# Altium project STM32F407.PrjPcb
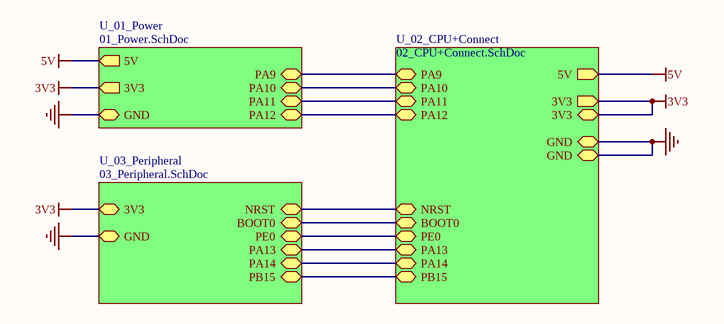
[diagram p0: STM32F407.SchDoc]
4 sheets, 49 parts. Net scope: hierarchical (ports join the sheet entries above them; power ports are global).
Board file: STM32F407.PcbDoc
Sheets:
  STM32F407.SchDoc
    U_01_Power = 01_Power.SchDoc
    U_02_CPU+Connect = 02_CPU+Connect.SchDoc
    U_03_Peripheral = 03_Peripheral.SchDoc

## Sheet STM32F407.SchDoc
size A4; SheetNumber: 1; SheetTotal: 4

### Sub-sheets
U_01_Power = 01_Power.SchDoc: 3V3 (out), GND (bidir), PA9 (bidir), PA10 (bidir), PA11 (bidir), PA12 (bidir), 5V (out)
U_02_CPU+Connect = 02_CPU+Connect.SchDoc: 3V3 (bidir), GND (bidir), NRST (bidir), PB15 (bidir), BOOT0 (bidir), PE0 (bidir), PA13 (bidir), PA14 (bidir), 3V3 (out), GND (bidir), PA9 (bidir), PA10 (bidir), PA11 (bidir), PA12 (bidir), 5V (out)
U_03_Peripheral = 03_Peripheral.SchDoc: 3V3 (bidir), GND (bidir), NRST (bidir), PB15 (bidir), BOOT0 (bidir), PE0 (bidir), PA13 (bidir), PA14 (bidir)

### Nets
3V3: sheet U_01_Power/3V3, sheet U_02_CPU+Connect/3V3, sheet U_02_CPU+Connect/3V3, sheet U_03_Peripheral/3V3
5V: sheet U_01_Power/5V, sheet U_02_CPU+Connect/5V
GND: sheet U_01_Power/GND, sheet U_02_CPU+Connect/GND, sheet U_02_CPU+Connect/GND, sheet U_03_Peripheral/GND
BOOT0: sheet U_02_CPU+Connect/BOOT0, sheet U_03_Peripheral/BOOT0
NRST: sheet U_02_CPU+Connect/NRST, sheet U_03_Peripheral/NRST
PA9: sheet U_01_Power/PA9, sheet U_02_CPU+Connect/PA9
PA10: sheet U_01_Power/PA10, sheet U_02_CPU+Connect/PA10
PA11: sheet U_01_Power/PA11, sheet U_02_CPU+Connect/PA11
PA12: sheet U_01_Power/PA12, sheet U_02_CPU+Connect/PA12
PA13: sheet U_02_CPU+Connect/PA13, sheet U_03_Peripheral/PA13
PA14: sheet U_02_CPU+Connect/PA14, sheet U_03_Peripheral/PA14
PB15: sheet U_02_CPU+Connect/PB15, sheet U_03_Peripheral/PB15
PE0: sheet U_02_CPU+Connect/PE0, sheet U_03_Peripheral/PE0

## Sheet 01_Power.SchDoc
size A4; SheetNumber: 2; SheetTotal: 4
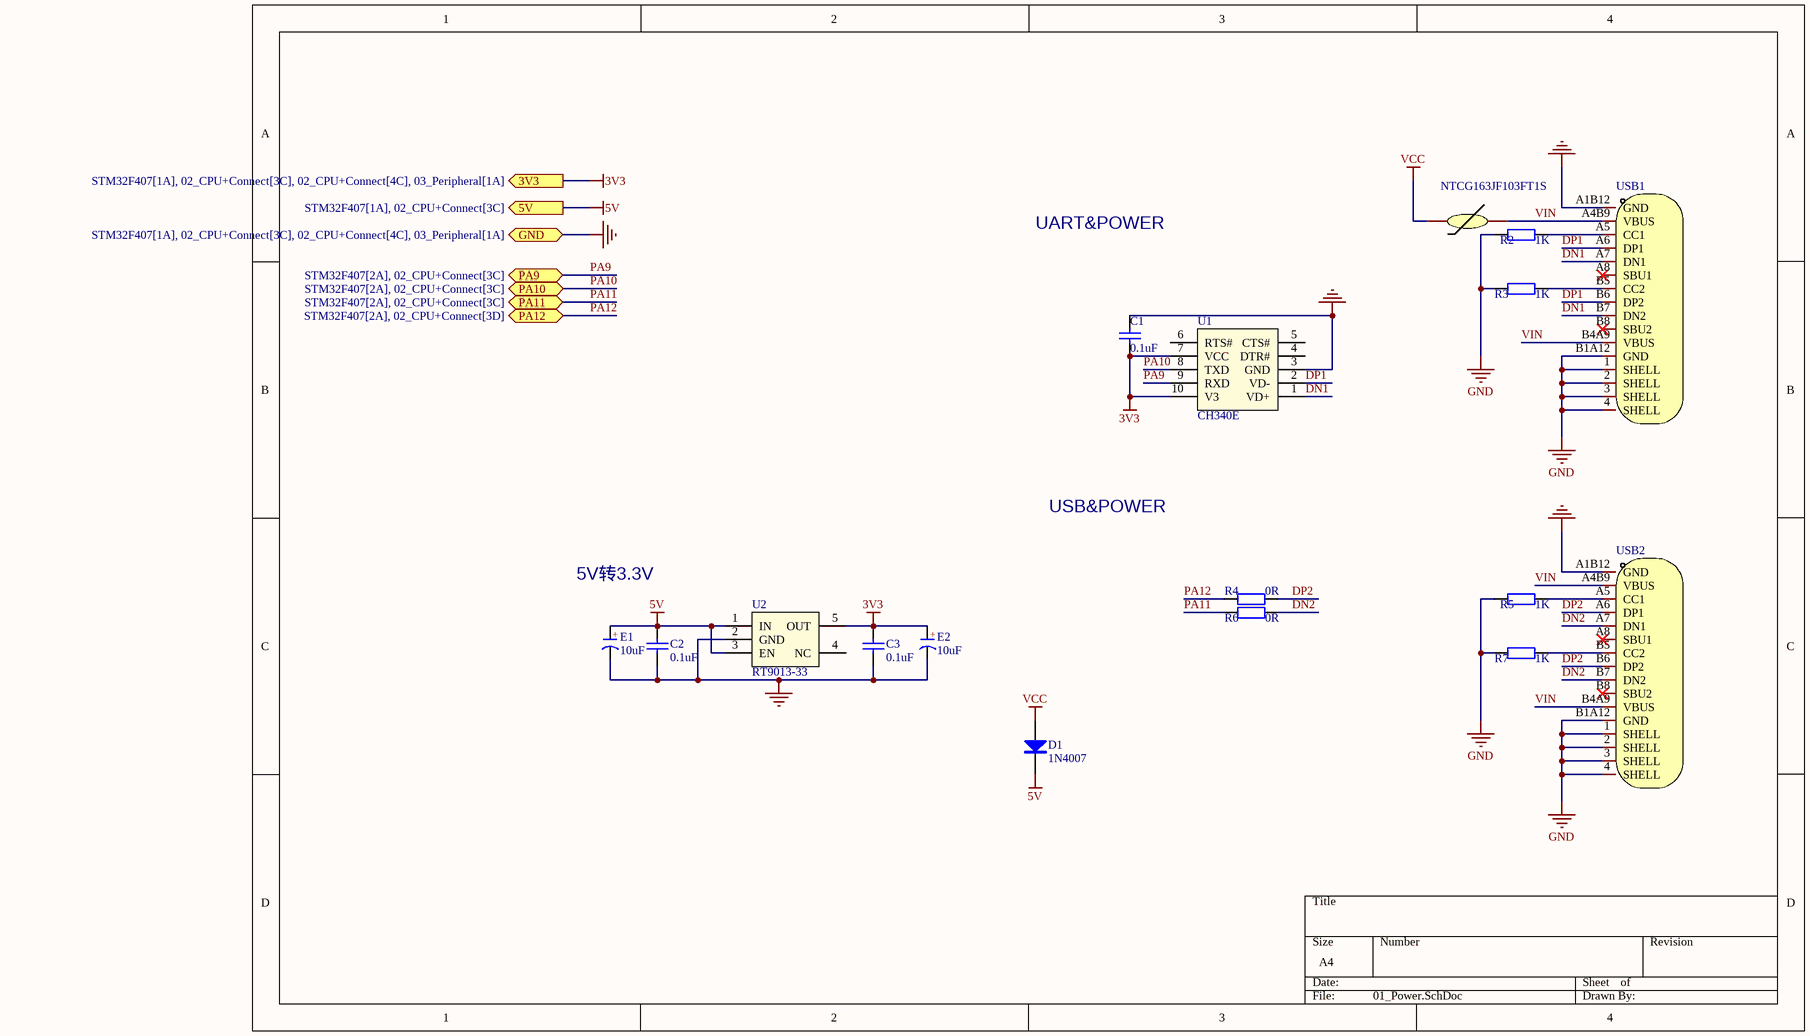
[diagram p1: 01_Power.SchDoc]

### Parts
C1  0.1uF  [C 0402_L]
C2  0.1uF  [C 0402_L]
C3  0.1uF  [C 0402_L]
D1  1N4007  [SOD-123]
E1  10uF  [CD A(3216)]
E2  10uF  [CD A(3216)]
R1  NTCG163JF103FT1S  [R0603]
R2  1K  [R 0402_L]
R3  1K  [R 0402_L]
R4  0R  [R 0402_L]
R5  1K  [R 0402_L]
R6  0R  [R 0402_L]
R7  1K  [R 0402_L]
U1  CH340E  [MSOP10_L]
U2  RT9013-33  [SOT23-5N]
USB1  TYPE-C 16P(073)  [USB-C-SMD_TYPE-C16PIN_C668624]  (value not drawn)
USB2  TYPE-C 16P(073)  [USB-C-SMD_TYPE-C16PIN_C668624]  (value not drawn)

### Ports
3V3 (out, see STM32F407[1A], 02_CPU+Connect[3C], 02_CPU+Connect[4C], 03_Peripheral[1A]), 5V (out, see STM32F407[1A], 02_CPU+Connect[3C]), GND (bidir, see STM32F407[1A], 02_CPU+Connect[3C], 02_CPU+Connect[4C], 03_Peripheral[1A]), PA9 (bidir, see STM32F407[2A], 02_CPU+Connect[3C]), PA10 (bidir, see STM32F407[2A], 02_CPU+Connect[3C]), PA11 (bidir, see STM32F407[2A], 02_CPU+Connect[3C]), PA12 (bidir, see STM32F407[2A], 02_CPU+Connect[3D])

### Nets
3V3: C1.2 C3.2 E2.1(A) U1.7(VCC) U1.10(V3) U2.5(OUT) ; port 3V3
5V: C2.2 D1.2(K) E1.1(A) U2.1(IN) U2.3(EN) ; port 5V
GND: C1.1 C2.1 C3.1 E1.2(K) E2.2(K) R2.1 R3.1 R5.1 R7.1 U1.3(GND) U2.2(GND) USB1.1(SHELL) USB1.2(SHELL) USB1.3(SHELL) USB1.4(SHELL) USB1.A1B12(GND) USB1.B1A12(GND) USB2.1(SHELL) USB2.2(SHELL) USB2.3(SHELL) USB2.4(SHELL) USB2.A1B12(GND) USB2.B1A12(GND) ; port GND
VCC: D1.1(A) R1.1
DN1: U1.1(VD+) USB1.A7(DN1) USB1.B7(DN2)
DN2: R6.1 USB2.A7(DN1) USB2.B7(DN2)
DP1: U1.2(VD-) USB1.A6(DP1) USB1.B6(DP2)
DP2: R4.1 USB2.A6(DP1) USB2.B6(DP2)
PA9: U1.9(RXD) ; port PA9
PA10: U1.8(TXD) ; port PA10
PA11: R6.2 ; port PA11
PA12: R4.2 ; port PA12
VIN: R1.2 USB1.A4B9(VBUS) USB1.B4A9(VBUS) USB2.A4B9(VBUS) USB2.B4A9(VBUS)
NetR2_2: R2.2 USB1.A5(CC1)
NetR3_2: R3.2 USB1.B5(CC2)
NetR5_2: R5.2 USB2.A5(CC1)
NetR7_2: R7.2 USB2.B5(CC2)

Not connected (* = marked no-connect by the designer): U1 4(DTR#) 5(CTS#) 6(RTS#); U2 4(NC); USB1 A8(SBU1)* B8(SBU2)*; USB2 A8(SBU1)* B8(SBU2)*

### Notes on the sheet
- UART&POWER
- USB&POWER
- 5V转3.3V
- (in symbol C-CD) +

### Library data of the parts
C1-C3 = Cap
D1 = 1N4007: 整流二极管; BOM名称: 整流二极管
E1 E2 = C-CD: 贴片钽电容; BOM名称: 贴片钽电容
R1 = NTCG163JF103FT1S: 阻值(25℃):10kΩ;电阻精度:±1%;B值精度:±1%;B值(25℃/50℃):3380K;功率:100mW;最大稳态电流(25℃):310uA;B值(25℃/75℃):3422K;B值(25℃/85℃):3435K;B值(25℃/100℃):3453K;工作温度:-40℃~+150℃;; Manufacturer: TDK; Add into BOM: yes; Resistance @ 25℃: 10kΩ; Resistance Tolerance: ±1%; B Constant (25℃/50℃): 3380K; Power: 100mW; Steady State Current (Max): 310uA; B Constant (25℃/75℃): 3422K; B Constant (25℃/85℃): 3435K; B Constant (25℃/100℃): 3453K; Symbol: NTCG163JF103FT1S; Device: NTCG163JF103FT1S; LCSC Part Name: 10kΩ 电阻精度:±1% 3380K; Supplier Part: C406719; Manufacturer Part: NTCG163JF103FT1S; Supplier Footprint: 0603; JLCPCB Part Class: 扩展库; Datasheet: https://atta.szlcsc.com/upload/public/pdf/source/20190723/C406719_56E4CA7886271F3E26D47484E1680181.pdf; Supplier: LCSC; Convert to PCB: yes; B Constant Tolerance: ±1%; Operating Temperature: -40℃~+150℃; Name: NTCG163JF103FT1S
R2-R7 = Res
USB1 USB2 = TYPE-C 16P(073): 连接器类型:Type-C;标准:-;公母:母座;触点数量:16;端口数量:1;安装方式:卧贴;额定电流 - 电源:5A;工作温度范围:-25℃~+85℃;; Manufacturer: SHOU HAN(首韩); Add into BOM: yes; Gender: 母座; Number of Contacts: 16; Number of Ports: 1; Mounting Sytle: 卧贴; Current Rating - Power (Max): 5A; Symbol: TYPE-C 16P(073); Device: TYPE-C 16P(073); LCSC Part Name: TYPE-C母座 16P 4脚插件带定位柱 不锈钢外壳 3次模顶; Supplier Part: C668624; Manufacturer Part: TYPE-C 16P(073); Supplier Footprint: SMD; JLCPCB Part Class: 扩展库; Datasheet: https://atta.szlcsc.com/upload/public/pdf/source/20200618/C668624_CC51EC37614090AAD56C1421DE954C80.pdf; Supplier: LCSC; Convert to PCB: yes; Connector Type: Type-C; Standard: -; Operating Temperature Range: -25℃~+85℃; NO_CONNECT: yes; Name: TYPE-C 16P(073)

## Sheet 02_CPU+Connect.SchDoc
size A4; SheetNumber: 3; SheetTotal: 4
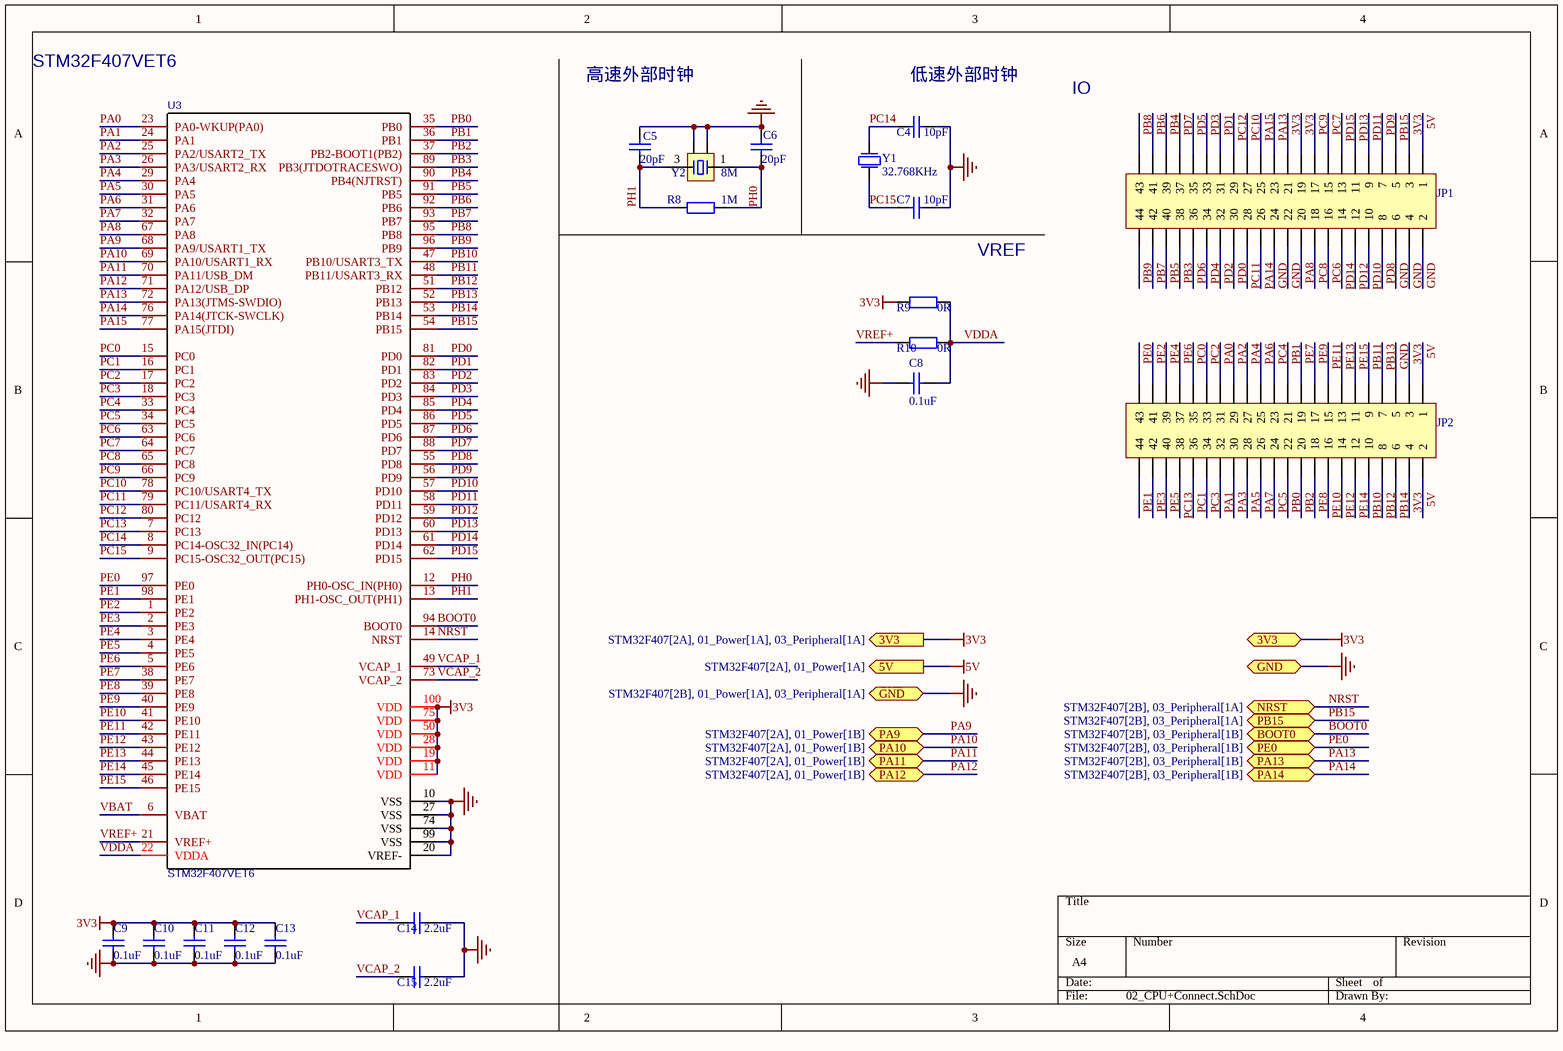
[diagram p2: 02_CPU+Connect.SchDoc]

### Parts
C4  10pF  [C 0402_L]
C5  20pF  [C 0402_L]
C6  20pF  [C 0402_L]
C7  10pF  [C 0402_L]
C8  0.1uF  [C 0402_L]
C9  0.1uF  [C 0402_L]
C10  0.1uF  [C 0402_L]
C11  0.1uF  [C 0402_L]
C12  0.1uF  [C 0402_L]
C13  0.1uF  [C 0402_L]
C14  2.2uF  [C 0402_L]
C15  2.2uF  [C 0402_L]
JP1  Header 2x22  [HDR2.54-LI-2x22P]  (value not drawn)
JP2  Header 2x22  [HDR2.54-LI-2x22P]  (value not drawn)
R8  1M  [R 0402_L]
R9  0R  [R 0402_L]
R10  0R  [R 0402_L]
U3  STM32F407VET6  [LQFP100 14x14_N]
Y1  32.768KHz  [FC135-3.2X1.5]
Y2  8M  [OSC 3225-4P]

### Ports
3V3 (bidir, see STM32F407[2A], 01_Power[1A], 03_Peripheral[1A]), 3V3 (out, see STM32F407[2A], 01_Power[1A], 03_Peripheral[1A]), 5V (out, see STM32F407[2A], 01_Power[1A]), BOOT0 (bidir, see STM32F407[2B], 03_Peripheral[1B]), GND (bidir, see STM32F407[2B], 01_Power[1A], 03_Peripheral[1A]), NRST (bidir, see STM32F407[2B], 03_Peripheral[1A]), PA9 (bidir, see STM32F407[2A], 01_Power[1B]), PA10 (bidir, see STM32F407[2A], 01_Power[1B]), PA11 (bidir, see STM32F407[2A], 01_Power[1B]), PA12 (bidir, see STM32F407[2A], 01_Power[1B]), PA13 (bidir, see STM32F407[2B], 03_Peripheral[1B]), PA14 (bidir, see STM32F407[2B], 03_Peripheral[1B]), PB15 (bidir, see STM32F407[2B], 03_Peripheral[1A]), PE0 (bidir, see STM32F407[2B], 03_Peripheral[1B])

### Nets
3V3: C9.1 C10.1 C11.1 C12.1 C13.1 JP1.3 JP1.19 JP1.21 JP2.3 JP2.4 R9.2 U3.11(VDD) U3.19(VDD) U3.28(VDD) U3.50(VDD) U3.75(VDD) U3.100(VDD) ; port 3V3
5V: JP1.1 JP2.1 JP2.2 ; port 5V
GND: C4.1 C5.1 C6.1 C7.1 C8.1 C9.2 C10.2 C11.2 C12.2 C13.2 C14.1 C15.1 JP1.2 JP1.4 JP1.6 JP1.22 JP1.24 JP2.5 U3.10(VSS) U3.20(VREF-) U3.27(VSS) U3.74(VSS) U3.99(VSS) Y2.2 Y2.4 ; port GND
BOOT0: U3.94(BOOT0) ; port BOOT0
NRST: U3.14(NRST) ; port NRST
PA0: JP2.31 U3.23(PA0-WKUP(PA0))
PA1: JP2.32 U3.24(PA1)
PA2: JP2.29 U3.25(PA2/USART2_TX)
PA3: JP2.30 U3.26(PA3/USART2_RX)
PA4: JP2.27 U3.29(PA4)
PA5: JP2.28 U3.30(PA5)
PA6: JP2.25 U3.31(PA6)
PA7: JP2.26 U3.32(PA7)
PA8: JP1.20 U3.67(PA8)
PA9: U3.68(PA9/USART1_TX) ; port PA9
PA10: U3.69(PA10/USART1_RX) ; port PA10
PA11: U3.70(PA11/USB_DM) ; port PA11
PA12: U3.71(PA12/USB_DP) ; port PA12
PA13: JP1.23 U3.72(PA13(JTMS-SWDIO)) ; port PA13
PA14: JP1.26 U3.76(PA14(JTCK-SWCLK)) ; port PA14
PA15: JP1.25 U3.77(PA15(JTDI))
PB0: JP2.22 U3.35(PB0)
PB1: JP2.21 U3.36(PB1)
PB2: JP2.20 U3.37(PB2-BOOT1(PB2))
PB3: JP1.38 U3.89(PB3(JTDOTRACESWO))
PB4: JP1.39 U3.90(PB4(NJTRST))
PB5: JP1.40 U3.91(PB5)
PB6: JP1.41 U3.92(PB6)
PB7: JP1.42 U3.93(PB7)
PB8: JP1.43 U3.95(PB8)
PB9: JP1.44 U3.96(PB9)
PB10: JP2.10 U3.47(PB10/USART3_TX)
PB11: JP2.9 U3.48(PB11/USART3_RX)
PB12: JP2.8 U3.51(PB12)
PB13: JP2.7 U3.52(PB13)
PB14: JP2.6 U3.53(PB14)
PB15: JP1.5 U3.54(PB15) ; port PB15
PC0: JP2.35 U3.15(PC0)
PC1: JP2.36 U3.16(PC1)
PC2: JP2.33 U3.17(PC2)
PC3: JP2.34 U3.18(PC3)
PC4: JP2.23 U3.33(PC4)
PC5: JP2.24 U3.34(PC5)
PC6: JP1.16 U3.63(PC6)
PC7: JP1.15 U3.64(PC7)
PC8: JP1.18 U3.65(PC8)
PC9: JP1.17 U3.66(PC9)
PC10: JP1.27 U3.78(PC10/USART4_TX)
PC11: JP1.28 U3.79(PC11/USART4_RX)
PC12: JP1.29 U3.80(PC12)
PC13: JP2.38 U3.7(PC13)
PC14: C4.2 U3.8(PC14-OSC32_IN(PC14)) Y1.1(P1)
PC15: C7.2 U3.9(PC15-OSC32_OUT(PC15)) Y1.2(P2)
PD0: JP1.30 U3.81(PD0)
PD1: JP1.31 U3.82(PD1)
PD2: JP1.32 U3.83(PD2)
PD3: JP1.33 U3.84(PD3)
PD4: JP1.34 U3.85(PD4)
PD5: JP1.35 U3.86(PD5)
PD6: JP1.36 U3.87(PD6)
PD7: JP1.37 U3.88(PD7)
PD8: JP1.8 U3.55(PD8)
PD9: JP1.7 U3.56(PD9)
PD10: JP1.10 U3.57(PD10)
PD11: JP1.9 U3.58(PD11)
PD12: JP1.12 U3.59(PD12)
PD13: JP1.11 U3.60(PD13)
PD14: JP1.14 U3.61(PD14)
PD15: JP1.13 U3.62(PD15)
PE0: JP2.43 U3.97(PE0) ; port PE0
PE1: JP2.44 U3.98(PE1)
PE2: JP2.41 U3.1(PE2)
PE3: JP2.42 U3.2(PE3)
PE4: JP2.39 U3.3(PE4)
PE5: JP2.40 U3.4(PE5)
PE6: JP2.37 U3.5(PE6)
PE7: JP2.19 U3.38(PE7)
PE8: JP2.18 U3.39(PE8)
PE9: JP2.17 U3.40(PE9)
PE10: JP2.16 U3.41(PE10)
PE11: JP2.15 U3.42(PE11)
PE12: JP2.14 U3.43(PE12)
PE13: JP2.13 U3.44(PE13)
PE14: JP2.12 U3.45(PE14)
PE15: JP2.11 U3.46(PE15)
PH0: C6.2 R8.1 U3.12(PH0-OSC_IN(PH0)) Y2.1
PH1: C5.2 R8.2 U3.13(PH1-OSC_OUT(PH1)) Y2.3
VBAT: U3.6(VBAT)
VCAP_1: C14.2 U3.49(VCAP_1)
VCAP_2: C15.2 U3.73(VCAP_2)
VDDA: C8.2 R9.1 R10.1 U3.22(VDDA)
VREF+: R10.2 U3.21(VREF+)

### Notes on the sheet
- STM32F407VET6
- 高速外部时钟
- (near C4) 低速外部时钟
- IO
- VREF

### Library data of the parts
C4-C15 = Cap
JP1 JP2 = Header 2x22: 2x22P接插件; BOM名称: 20*2P接插件
R8-R10 = Res
U3 = STM32F407VET6: BOM_Manufacturer: ST; subpart_no: 1; tags: STM32; BOM_Supplier Part: C28730; BOM_Supplier: LCSC; BOM_Manufacturer Part: STM32F407VET6; image: http://image.lceda.cn/szlcsc/C28730.jpg; spicePre: U; spiceSymbolName: STM32F407VET6
Y1 = XTAL-2P: vaule: 32.768KHz
Y2 = XTAL-4P: 4脚无源晶振; 负载电容: CL20pF; BOM名称: 4脚无源晶振

## Sheet 03_Peripheral.SchDoc
size A4; SheetNumber: 4; SheetTotal: 4
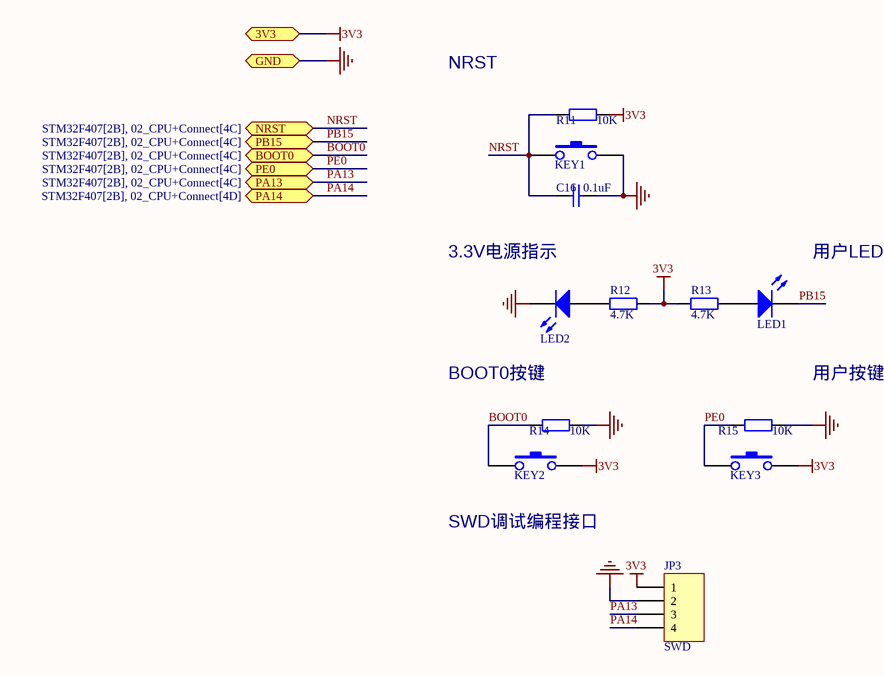
[diagram p3: 03_Peripheral.SchDoc]

### Parts
C16  0.1uF  [C 0402_L]
JP3  SWD  [HDR2.54-WS-4P]
KEY1  KEY  [SWT3*4]  (value not drawn)
KEY2  KEY  [SWT3*4]  (value not drawn)
KEY3  KEY  [SWT3*4]  (value not drawn)
LED1  LED  [LED 0603]  (value not drawn)
LED2  LED  [LED 0603]  (value not drawn)
R11  10K  [R 0402_L]
R12  4.7K  [R 0402_L]
R13  4.7K  [R 0402_L]
R14  10K  [R 0402_L]
R15  10K  [R 0402_L]

### Ports
3V3 (bidir, see STM32F407[1B], 01_Power[1A], 02_CPU+Connect[3C], 02_CPU+Connect[4C]), BOOT0 (bidir, see STM32F407[2B], 02_CPU+Connect[4C]), GND (bidir, see STM32F407[1B], 01_Power[1A], 02_CPU+Connect[3C], 02_CPU+Connect[4C]), NRST (bidir, see STM32F407[2B], 02_CPU+Connect[4C]), PA13 (bidir, see STM32F407[2B], 02_CPU+Connect[4C]), PA14 (bidir, see STM32F407[2B], 02_CPU+Connect[4D]), PB15 (bidir, see STM32F407[2B], 02_CPU+Connect[4C]), PE0 (bidir, see STM32F407[2B], 02_CPU+Connect[4C])

### Nets
3V3: JP3.1 KEY2.2 KEY3.2 R11.1 R12.1 R13.1 ; port 3V3
GND: C16.1 JP3.2 KEY1.2 LED2.2(K) R14.1 R15.1 ; port GND
BOOT0: KEY2.1 R14.2 ; port BOOT0
NRST: C16.2 KEY1.1 R11.2 ; port NRST
PA13: JP3.3 ; port PA13
PA14: JP3.4 ; port PA14
PB15: LED1.2(K) ; port PB15
PE0: KEY3.1 R15.2 ; port PE0
NetLED1_1: LED1.1(A) R13.2
NetLED2_1: LED2.1(A) R12.2

### Notes on the sheet
- NRST
- 3.3V电源指示
- 用户LED
- BOOT0按键
- 用户按键
- (near KEY2) SWD调试编程接口

### Library data of the parts
C16 = Cap
JP3 = Header 1*4: LatestRevisionDate: 17-Jul-2002; LatestRevisionNote: Re-released for DXP Platform.; Publisher: Altium Limited
R11-R15 = Res

## Nets that join several sheets
3V3: 01_Power (6 pins), 02_CPU+Connect (17 pins), 03_Peripheral (6 pins)
5V: 01_Power (5 pins), 02_CPU+Connect (JP1.1 JP2.1 JP2.2)
GND: 01_Power (23 pins), 02_CPU+Connect (25 pins), 03_Peripheral (6 pins)
BOOT0: 02_CPU+Connect (U3.94), 03_Peripheral (KEY2.1 R14.2)
NRST: 02_CPU+Connect (U3.14), 03_Peripheral (C16.2 KEY1.1 R11.2)
PA9: 01_Power (U1.9), 02_CPU+Connect (U3.68)
PA10: 01_Power (U1.8), 02_CPU+Connect (U3.69)
PA11: 01_Power (R6.2), 02_CPU+Connect (U3.70)
PA12: 01_Power (R4.2), 02_CPU+Connect (U3.71)
PA13: 02_CPU+Connect (JP1.23 U3.72), 03_Peripheral (JP3.3)
PA14: 02_CPU+Connect (JP1.26 U3.76), 03_Peripheral (JP3.4)
PB15: 02_CPU+Connect (JP1.5 U3.54), 03_Peripheral (LED1.2)
PE0: 02_CPU+Connect (JP2.43 U3.97), 03_Peripheral (KEY3.1 R15.2)